# Altium schematic sheet CHRT.SchDoc
size A3; SheetNumber: 6; SheetTotal: 9
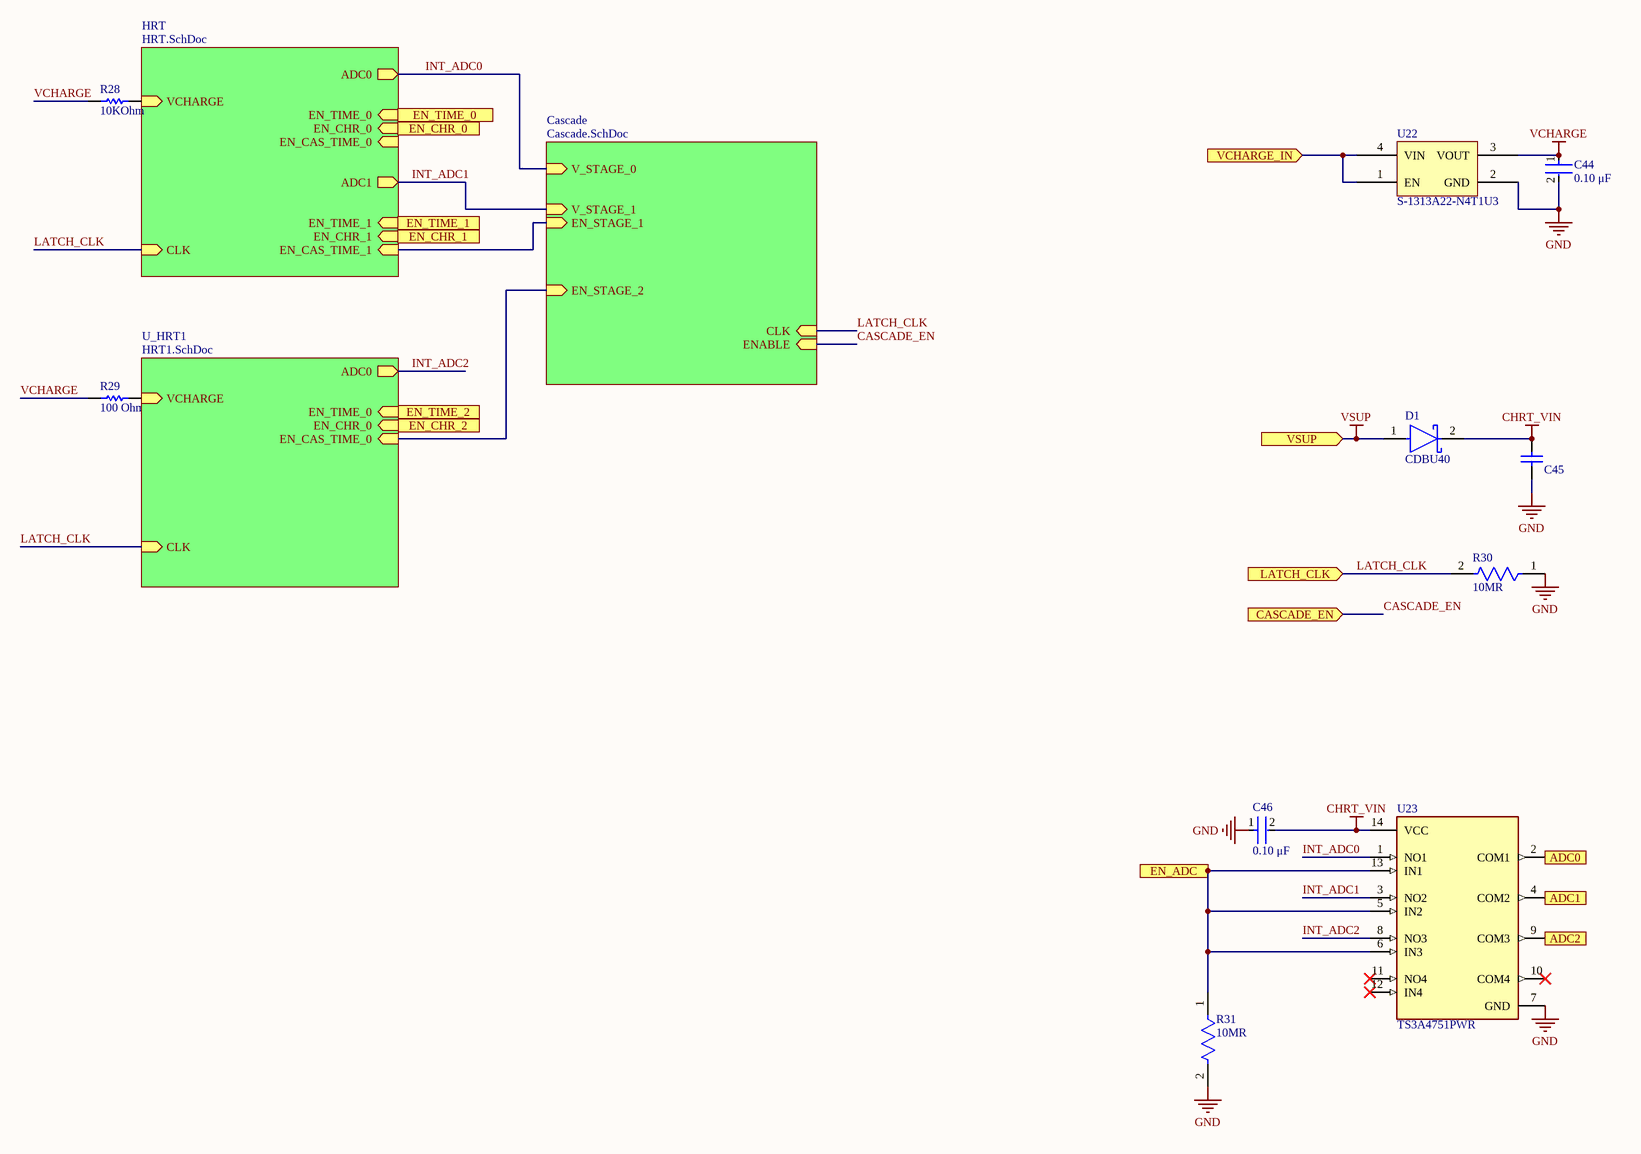
[diagram p0: CHRT.SchDoc]

## Parts
C44  Capacitance: 0.10 μF  [FP-C0402-BB-MFG]  (hidden comment: C0402C104K8PACTU)
C45  ZRB15XR61A106ME01D  [CAPC1005X55X25NL05T10]  (value not drawn)
C46  Capacitance: 0.10 μF  [FP-C0402-BB-MFG]  (hidden comment: C0402C104K8PACTU)
D1  CDBU40  [FP-S8-V-3880_02-001-MFG]
R28  Resistance: 10KOhm  [RESC1005X40X25LL05T05]  (hidden comment: RMCF0402FT10K0)
R29  Resistance: 100 Ohm  [RESC1005X40X25LL05T05]  (hidden comment: ERJ-2RKF1000X)
R30  Resistance: 10MR  [FP-CRCW0402-e3-IPC_C]  (hidden comment: CRCW040210M0JNED)
R31  Resistance: 10MR  [FP-CRCW0402-e3-IPC_C]  (hidden comment: CRCW040210M0JNED)
U22  S-1313A22-N4T1U3  [SOT130P210X110-4N]
U23  TS3A4751PWR  [FP-PW0014A-IPC_C]

## Sub-sheets
Cascade = Cascade.SchDoc: V_STAGE_0 (in), V_STAGE_1 (in), EN_STAGE_1 (in), EN_STAGE_2 (in), CLK (in), ENABLE (in)
HRT = HRT.SchDoc: VCHARGE (in), CLK (in), ADC0 (out), EN_TIME_0 (in), EN_CHR_0 (in), EN_CAS_TIME_0 (in), ADC1 (out), EN_TIME_1 (in), EN_CHR_1 (in), EN_CAS_TIME_1 (in)
U_HRT1 = HRT1.SchDoc: VCHARGE (in), CLK (in), ADC0 (out), EN_TIME_0 (in), EN_CHR_0 (in), EN_CAS_TIME_0 (in)

## Ports
ADC0 (in), ADC1 (in), ADC2 (in), CASCADE_EN (in), EN_ADC (in), EN_CHR_0 (in), EN_CHR_1 (in), EN_CHR_2 (in), EN_TIME_0 (in), EN_TIME_1 (in), EN_TIME_2 (in), LATCH_CLK (in), VCHARGE_IN (in), VSUP (in)

## Nets
CHRT_VIN: C45.2 C46.2 D1.2(C) U23.14(VCC)
GND: C44.2 C45.1 C46.1 R30.1 R31.2 U22.2(GND) U23.7(GND)
VCHARGE: C44.1 R28.1 R29.1 U22.3(VOUT)
VSUP: D1.1(A) ; port VSUP
ADC0: U23.2(COM1) ; port ADC0
ADC1: U23.4(COM2) ; port ADC1
ADC2: U23.9(COM3) ; port ADC2
CASCADE_EN: port CASCADE_EN, sheet Cascade/ENABLE
EN_ADC: R31.1 U23.5(IN2) U23.6(IN3) U23.13(IN1) ; port EN_ADC
EN_CHR_0: port EN_CHR_0, sheet HRT/EN_CHR_0
EN_CHR_1: port EN_CHR_1, sheet HRT/EN_CHR_1
EN_CHR_2: port EN_CHR_2, sheet U_HRT1/EN_CHR_0
EN_TIME_0: port EN_TIME_0, sheet HRT/EN_TIME_0
EN_TIME_1: port EN_TIME_1, sheet HRT/EN_TIME_1
EN_TIME_2: port EN_TIME_2, sheet U_HRT1/EN_TIME_0
INT_ADC0: U23.1(NO1) ; sheet HRT/ADC0, sheet Cascade/V_STAGE_0
INT_ADC1: U23.3(NO2) ; sheet HRT/ADC1, sheet Cascade/V_STAGE_1
INT_ADC2: U23.8(NO3) ; sheet U_HRT1/ADC0
LATCH_CLK: R30.2 ; port LATCH_CLK, sheet HRT/CLK, sheet Cascade/CLK, sheet U_HRT1/CLK
VCHARGE_IN: U22.1(EN) U22.4(VIN) ; port VCHARGE_IN
NetR28_2: R28.2 ; sheet HRT/VCHARGE
NetR29_2: R29.2 ; sheet U_HRT1/VCHARGE
(unnamed): sheet HRT/EN_CAS_TIME_1, sheet Cascade/EN_STAGE_1
(unnamed): sheet Cascade/EN_STAGE_2, sheet U_HRT1/EN_CAS_TIME_0

Not connected (* = marked no-connect by the designer): U23 10(COM4)* 11(NO4)* 12(IN4)*

## Library data of the parts
C44 C46 = CMP-2008-02046-2: CAP CER 0.1UF 10V X5R 0402; Manufacturer: Kemet; Material: Ceramic; Temperature Coefficient: 15%; Tolerance: 0.1; Value: 0.10 μF; Package: C0402-BB; Temperature: -55°C to +125°C; ComponentLink2Description: Datasheet; Temperature Characteristic: X5R; Device Class L1: Passive Components; Height: 0.55mm; Lead Free: Yes; ComponentLink2URL: https://content.kemet.com/datasheets/KEM_C1002_X7R_SMD.pdf; Device Class L2: Capacitors; Temperature Range Low: -55°C; Temperature Range High: +125°C; RoHS: TRUE; Octopart: https://octopart.com/c0402c104k8pactu-kemet-140039; Automotive: No; Mouser Description: Capacitor 100 nF 10 VDC 0402; Category: Cap; Voltage Rating: 10 V; Digikey Description: CAP CER 0.1UF 10V X5R 0402; Ipc Land Pattern Name: CAPC10050X50; Device Class L3: Ceramic Capacitors; Manufacturer Part Number: C0402C104K8PACTU
C45 = CMP-2008-04012-1: Manufacturer: Murata; Part Number: GRM155R60G106ME44D; Capacitance: 10uF
D1 = CMP-02539-000026-1: DIODE SCHOTTKY 40V 120MA SOD523; Manufacturer: Vishay; Manufacturer Part Number: BAS40-02V-V-G-08; Max Surge Forward Current: 600mA; Max Junction Temp: +125°C; Peak Reverse Current: 0.02uA; Capacitance: 4pF; Value: 4pF; Temperature: to +125°C; Octopart: https://octopart.com/bas40-02v-v-g-08-vishay-44351221; Device Class L3: Schottky Diodes; RoHS: TRUE; Category: Diode; Digikey Description: DIODE SCHOTTKY 40V 120MA SOD523; Forward Current: 120mA; Automotive: No; Mouser Description: BAS40 Series 40 V 120 mA Surface Mount Small Signal Schottky Diode - SOD-523; Package: S8-V-3880.02-001; Device Class L2: Diodes; ComponentLink2URL: https://www.vishay.com/docs/82391/bas4002v.pdf; Temperature Range High: +125°C; Lead Free: Yes; Reverse Voltage: 40V; ComponentLink2Description: Datasheet; Height: 0.7mm; Max Repetitive Reverse Voltage: 40V; Device Class L1: Discrete Semiconductors
R28 = CMP-2000-07588-1: Chip Resistor, 10 KOhm, +/- 1%, 0.1 W, -55 to 155 degC, 0402 (1005 Metric), RoHS, Tape and Reel; Manufacturer: Panasonic; Power Rating: 100mW; Voltage Rating: 50V; Case\/Package: 0402; Temperature Coefficient: 100ppm\/degreesC; RoHSCompliant: True; Lead Free: LeadFree; Package Quantity: 1; Contact Plating: Tin; Length: 1mm; Radiation Hardening: No; REACH SVHC: NoSVHC; Max Operating Temperature: 155degC; Depth: 0.5mm; Case Code (Imperial): 0402; Military Standard: Not; Package Description: 2-Pin Surface Mount Device, Body 1 x 0.5 mm; Termination: SMD/SMT; Case Code (Metric): 1005; Height: 0.35mm; Packaging: TapeandReel; Voltage Rating (DC): 50V; Package Reference: 402; Number of Pins: 2; Tolerance: 1%; Mounting Technology: SurfaceMount; Width: 0.02inch; Mount: SurfaceMount; Datasheet URL: https://industrial.panasonic.com/cdbs/www-data/pdf/RDA0000/AOA0000C304.pdf; Composition: ThickFilm; Datasheet Version: 02/2017; Manufacturer URL: http://www.panasonic.com/; Max Power Dissipation: 100mW; Number of Terminations: 2; Min Operating Temperature: -55degC
R29 = CMP-2002-00605-3: Chip Resistor, 100 Ohm, +/- 1%, 100 mW, -55 to 155 degC, 0402 (1005 Metric), RoHS, Tape and Reel; Manufacturer: Basic Passives; Power Rating: 100 mW; Voltage Rating: 50 V; Case\/Package: 0402; Width: 0.5 mm; Pins: 2; ComponentLink2Description: Datasheet; PackageReference: 0402; Height: 0.35 mm; Tolerance: 1%; DatasheetVersion: 04/2015; Case Code (Imperial): 0402; Min Operating Temperature: -55 degC; Radiation Hardening: No; Length: 1 mm; Package Quantity: 10000; PackageDescription: 2-Pin Surface Mount Device, Body 1 x 0.5 mm; Mounting Technology: Surface Mount; Case Code (Metric): 1005; Packaging: Tape and Reel; ComponentLink1URL: http://www.panasonic.com/; RoHSCompliant: true; Max Operating Temperature: 155 degC; REACH SVHC: Yes; PartNumber: ERJ-2RKF1000X; ComponentLink1Description: Manufacturer URL; ComponentLink2URL: http://industrial.panasonic.com/cdbs/www-data/pdf/RDA0000/AOA0000C86.pdf; Mount: Surface Mount
R30 R31 = CMP-1011-00170-3: RES Thick Film, 10MΩ, 5%, 0.063W, 200ppm/°C, 0402; Voltage Rating (DC): 50V; Max Power Dissipation: 63mW; Case Code (Metric): 1005; Tolerance: 5%; Lead Free: Lead Free; Length: 1mm; Packaging: Tape and Reel; Depth: 0.5mm; Composition: Thick Film; Temperature Coefficient: 200ppm/°C; Package Quantity: 1; Radiation Hardening: No; Weight: 2.3E-05oz; Width: 0.5mm; Military Standard: Not; Power Rating: 63mW; Case/Package: 0402; Termination: SMD/SMT; Height: 0.016inch; Voltage Rating: 50V; Contact Plating: Tin; Number of Terminations: 2; Features: Automotive AEC-Q200; Max Operating Temperature: 155°C; Case Code (Imperial): 0402; Min Operating Temperature: -55°C
U23 = CMP-04892-000059-1: IC SWITCH QUAD SPST 14TSSOP; Bandwidth: 125MHz; High Level Output Current: 100mA; Max Supply Voltage: 3.6V; Operating Supply Voltage: 3V; Polarity: Non-Inverting; Turn-Off Delay Time: 9ns; On-State Resistance: 900mR; Supply Type: Single; Max Supply Current: 75nA; Number of Inputs: 4; Turn-On Delay Time: 14ns; Min Supply Voltage: 1.6V; Packaging: Tape and Reel; Contact Plating: Gold; Mount: Surface Mount; Low Level Output Current: 100mA; Termination: SMD/SMT; Min Operating Temperature: -40°C; Case/Package: TSSOP; REACH SVHC: No SVHC; Weight: 0.002018oz; Number of Pins: 14; Throw Configuration: SPST; Height: 1.05mm; Radiation Hardening: No; Length: 5.1mm; Max Operating Temperature: 85°C; Package Quantity: 1; Lead Free: Lead Free; RoHS Compliant: Yes; Number of Channels: 4; Number of Outputs: 4; Width: 4.5mm